# Altium schematic sheet NNLightSwitcher_analog.SchDoc
size A4
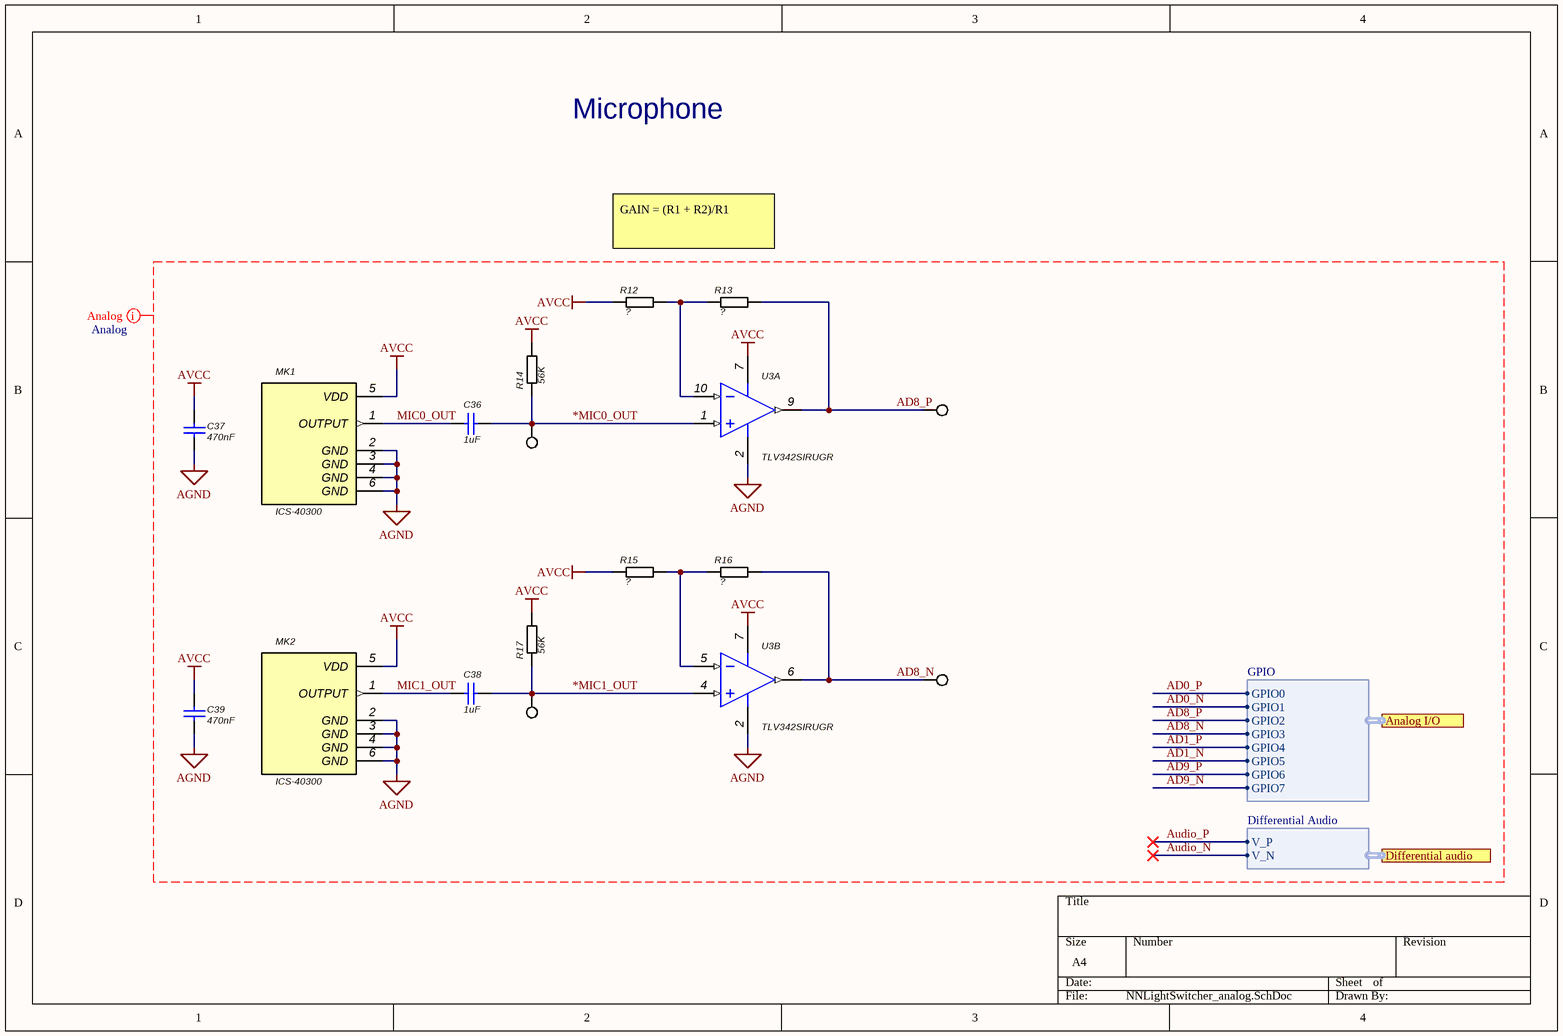
[diagram p0: NNLightSwitcher_analog.SchDoc]

## Parts
C36  1uF  [0402]
C37  470nF  [0402]
C38  1uF  [0402]
C39  470nF  [0402]
MK1  ICS-40300  [*MIC_ICS-40300]
MK2  ICS-40300  [*MIC_ICS-40300]
R12  ?  [0402]
R13  ?  [0402]
R14  56K  [0402]
R15  ?  [0402]
R16  ?  [0402]
R17  56K  [0402]
TP3  Test point  [Testpoint_with_pad]  (value not drawn)
TP4  Test point  [Testpoint_with_pad]  (value not drawn)
TP5  Test point  [Testpoint_with_pad]  (value not drawn)
TP6  Test point  [Testpoint_with_pad]  (value not drawn)
U3  TLV342SIRUGR  [TI-RUG10_V]  (parts A,B of 2)

## Ports
Analog I/O (harness GPIO), Differential audio (harness Differential Audio)

## Harnesses
GPIO: GPIO7, GPIO6, GPIO5, GPIO4, GPIO3, GPIO2, GPIO1, GPIO0
Differential Audio: V_N, V_P

## Nets
AGND: C37.2 C39.2 MK1.2(GND) MK1.3(GND) MK1.4(GND) MK1.6(GND) MK2.2(GND) MK2.3(GND) MK2.4(GND) MK2.6(GND) U3.2(GND)
AVCC: C37.1 C39.1 MK1.5(VDD) MK2.5(VDD) R12.1 R14.2 R15.1 R17.2 U3.7(V+)
*MIC0_OUT: C36.1 R14.1 TP4.1 U3.1(IN1+)
*MIC1_OUT: C38.1 R17.1 TP6.1 U3.4(IN2+)
AD0_N: port Analog I/O.GPIO1
AD0_P: port Analog I/O.GPIO0
AD1_N: port Analog I/O.GPIO5
AD1_P: port Analog I/O.GPIO4
AD8_N: R16.2 TP5.1 U3.6(OUT2) ; port Analog I/O.GPIO3
AD8_P: R13.2 TP3.1 U3.9(OUT1) ; port Analog I/O.GPIO2
AD9_N: port Analog I/O.GPIO7
AD9_P: port Analog I/O.GPIO6
Audio_N: port Differential audio.V_N
Audio_P: port Differential audio.V_P
MIC0_OUT: C36.2 MK1.1(OUTPUT)
MIC1_OUT: C38.2 MK2.1(OUTPUT)
NetR12_2: R12.2 R13.1 U3.10(IN1-)
NetR15_2: R15.2 R16.1 U3.5(IN2-)

## Layout directives
net class Analog: *MIC0_OUT, *MIC1_OUT, AD0_N, AD0_P, AD1_N, AD1_P, AD8_N, AD8_P, AD9_N, AD9_P, AGND, Audio_N, Audio_P, AVCC, MIC0_OUT, MIC1_OUT

## Notes on the sheet
- Microphone
- GAIN = (R1 + R2)/R1

## Library data of the parts
C36 C38 = Capacitor 1uF: ComponentLink1Description: Datasheet link; ComponentLink1URL: http://www.yageo.com/documents/recent/UPY-GP_NP0_16V-to-50V_16.pdf
C37 C39 = Capacitor 470nF: ComponentLink1Description: Datasheet link; ComponentLink1URL: http://www.yageo.com/documents/recent/UPY-GP_NP0_16V-to-50V_16.pdf
MK1 MK2 = ICS-40300: High SPL Analog MEMS Microphone with Extended Low Feq Response; Manufacturer 1: TDK InvenSense; Direction: Omnidirectional; Impedance: 200R; Max Supply Voltage: 3.63V; Min Supply Voltage: 1.5V; Operating Supply Current: 250uA; Shape: Rectangular; Value: *; ComponentLink1Description: http://43zrtwysvxb2gf29r5o0athu.wpengine.netdna-cdn.com/wp-content/uploads/2015/02/DS-ICS-40300-00-v1.1.pdf?src-supplier=Avnet+Asia; ComponentLink1URL: http://43zrtwysvxb2gf29r5o0athu.wpengine.netdna-cdn.com/wp-content/uploads/2015/02/DS-ICS-40300-00-v1.1.pdf?src-supplier=Avnet+Asia; ComponentLink2Description: https://www.invensense.com/wp-content/uploads/2015/02/DS-ICS-40300-00-v1.1.pdf?src-supplier=Digi-Key; ComponentLink2URL: https://www.invensense.com/wp-content/uploads/2015/02/DS-ICS-40300-00-v1.1.pdf?src-supplier=Digi-Key; Height: 3.5mm; Lead Free: Lead Free; Length: 4.72mm; Manufacturer Part Number 1: ICS-40300; Output Type: Analog; Packaging: Tape and Reel; Pricing 1: 1=3,00000, 10=2,48900, 25=2,29760, 50=2,15880, 100=2,02510, 500=1,73498, 1000=1,71600 (USD); RoHS: Yes; Stock 1: 3930; Supplier 1: Digi-Key; Supplier Part Number 1: 1428-1027-1-ND; Termination: Solder; Width: 3.76mm
R12 R13 R15 R16 = Resistor generic
R14 R17 = Resistor 56K
TP3-TP6 = Test point: Test Point, Miniature, SMT; ComponentLink1Description: Datasheet URL; ComponentLink1URL: http://www.keyelco.com/userAssets/store/files/5015.PDF
U3 = TLV342SIRUGR: Low-Voltage, Rail-To-Rail Output CMOS Operational Amplifier with Shutdown, 1.5 to 5.5 V, -40 to 125 degC, 10-pin X2QFN (RUG10), Green (RoHS & no Sb/Br); Manufacturer 1: Texas Instruments; Number of Channels: 2; Bandwidth: 2.2MHz; Common Mode Rejection Ratio: 50dB; Gain Bandwidth Product: 2.3MHz; Input Bias Current: 3nA; Input Offset Voltage (Vos): 4mV; Max Supply Voltage: 5.5V; Min Supply Voltage: 1.5V; Nominal Supply Current: 300uA; Operating Supply Current: 75uA; Output Current: 115mA; Slew Rate: 0.9V/µs; Voltage Gain: 110dB; ComponentLink1URL: http://www.ti.com/; ComponentLink1Description: Manufacturer URL; ComponentLink2Description: Datasheet; ComponentLink3URL: http://www.ti.com/litv/pdf/mpqf216a; ComponentLink2URL: http://www.ti.com/lit/ds/symlink/tlv342s.pdf; ComponentLink3Description: Package Specification; Case/Package: QFN; ComponentLink4Description: https://datasheet.ciiva.com/7411/tlv342-7411306.pdf?src-supplier=Newark; ComponentLink4URL: https://datasheet.ciiva.com/7411/tlv342-7411306.pdf?src-supplier=Newark; ComponentLink5Description: https://datasheet.ciiva.com/14458/tlv341-14458822.pdf?src-supplier=Avnet; ComponentLink5URL: https://datasheet.ciiva.com/14458/tlv341-14458822.pdf?src-supplier=Avnet; ComponentLink6Description: https://datasheet.ciiva.com/1797/tlv342-1797900.pdf?src-supplier=Digi-Key; ComponentLink6URL: https://datasheet.ciiva.com/1797/tlv342-1797900.pdf?src-supplier=Digi-Key; ComponentLink7Description: https://datasheet.ciiva.com/1797/tlv342-1797901.pdf?src-supplier=Digi-Key; ComponentLink7URL: https://datasheet.ciiva.com/1797/tlv342-1797901.pdf?src-supplier=Digi-Key; ComponentLink8Description: https://datasheet.ciiva.com/1797/tlv342-1797902.pdf?src-supplier=Digi-Key; ComponentLink8URL: https://datasheet.ciiva.com/1797/tlv342-1797902.pdf?src-supplier=Digi-Key; Lead Free: Lead Free; Manufacturer 2: Texas Instruments; Manufacturer Part Number 1: TLV342SIRUGR; Manufacturer Part Number 2: TLV342SIRUGR; Max I/O Voltage: 4mV; Max Operating Temperature: 125°C; Min Operating Temperature: -40°C; Nominal Gain Bandwidth Product: 2.2MHz; Number of Circuits: 2; Number of Elements: 2; Number of Pins: 10; Output Current per Channel: 115mA; Package Quantity: 3000; Packaging: Tape and Reel; Pricing 1: 1=1,13000, 10=1,00600, 100=0,78410, 500=0,64776, 1000=0,51140 (USD); Pricing 2: 1=1,09000, 10=0,92700, 50=0,92700, 100=0,71200, 500=0,62900, 1000=0,49700, 3000=0,44100, 9000=0,42400, 10000=0,42400 (USD); Radiation Hardening: No; RoHS: Yes; Stock 1: 21365; Stock 2: 4400; Supplier 1: Digi-Key; Supplier 2: Mouser; Supplier Part Number 1: 296-24767-1-ND; Supplier Part Number 2: 595-TLV342SIRUGR; Unity Gain Bandwidth Product: 2.3MHz